# EAGLE design mr_radar_pulser (EAGLE 6.1)
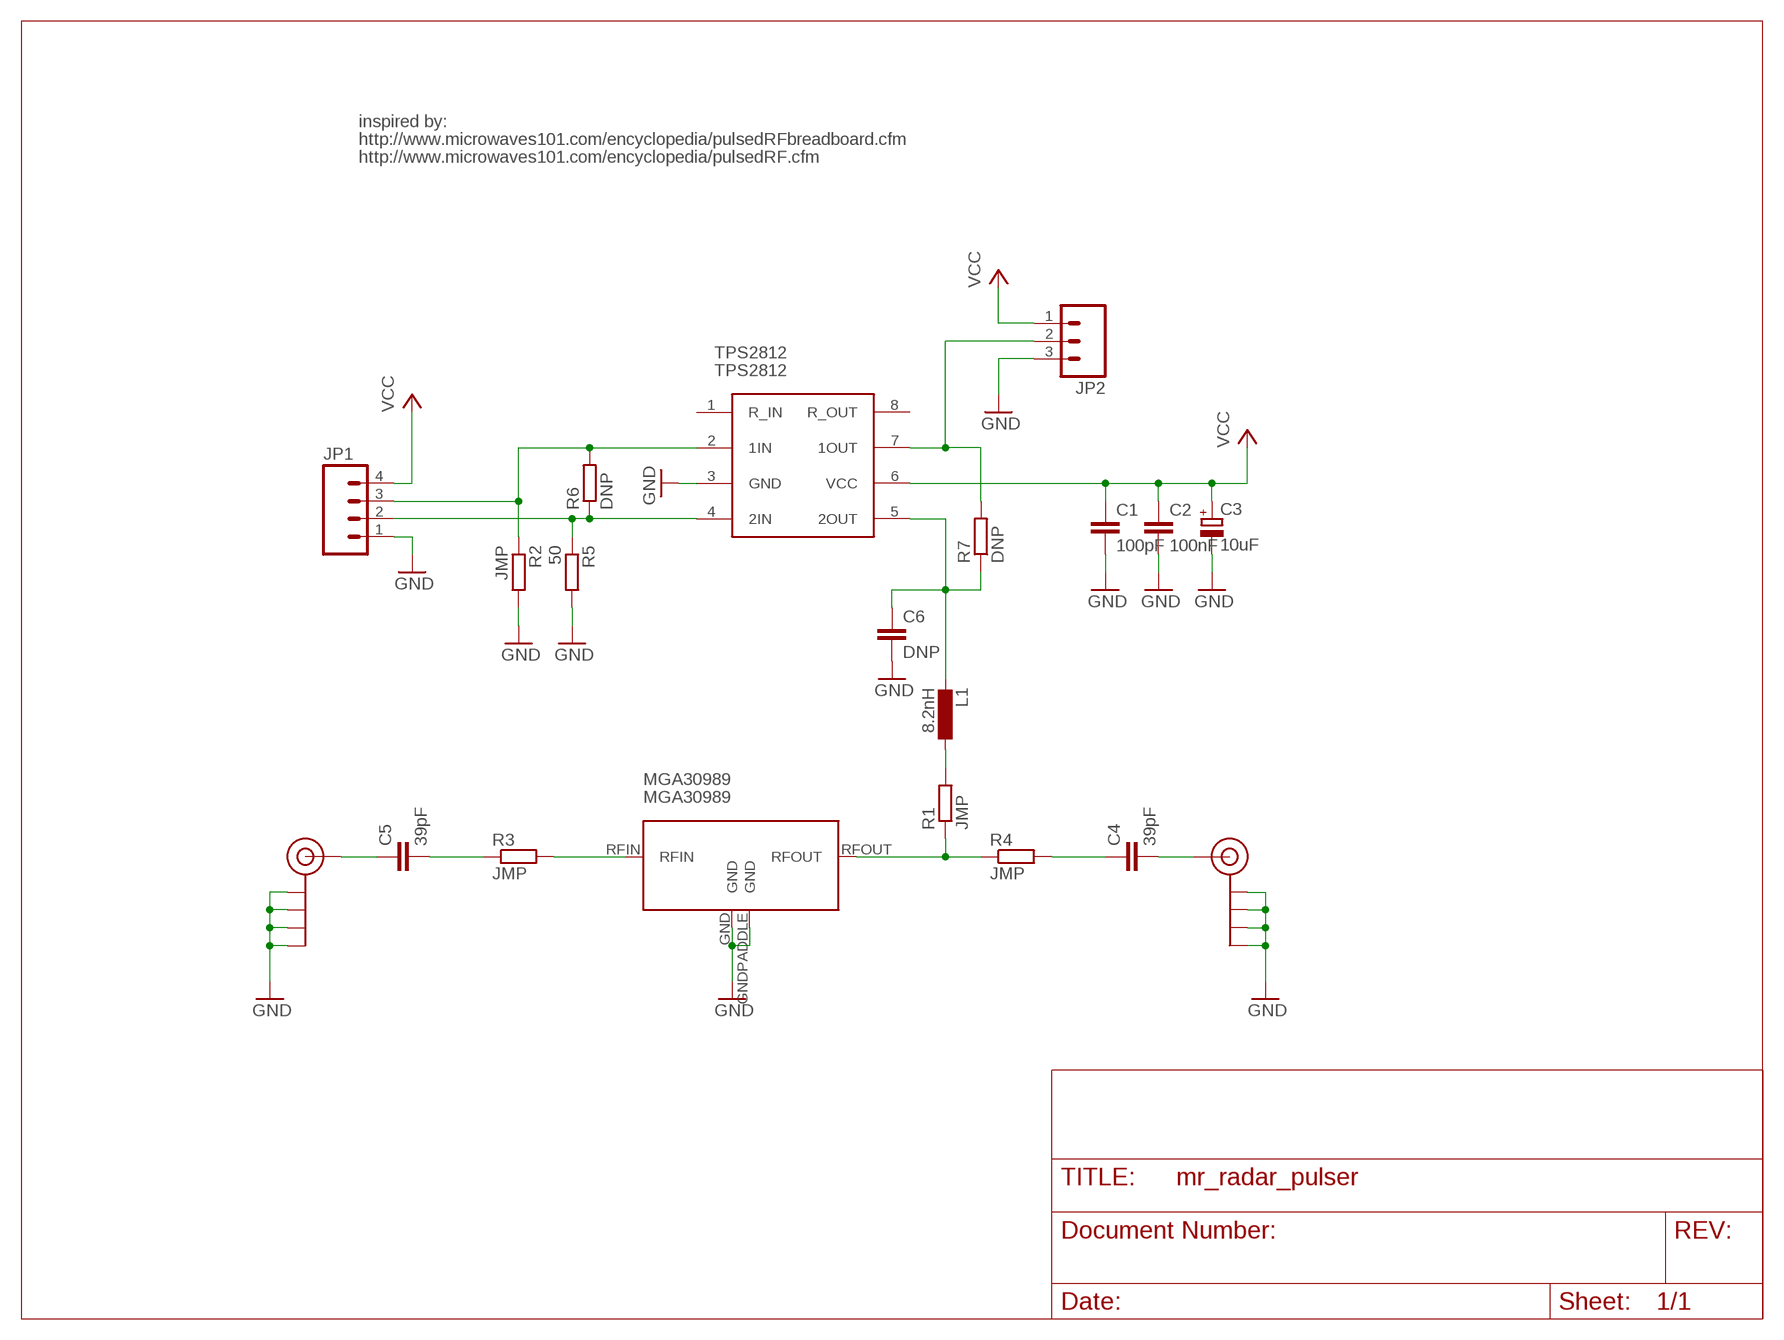
[diagram p0: schematic, sheet 1]

## Parts
C1  100pF  C-EUC0603  [C0603]
C2  100nF  C-EUC0603  [C0603]
C3  10uF  CPOL-EUCT3216  [CT3216]
C4  39pF  C-EUC0402  [C0402]
C5  39pF  C-EUC0402  [C0402]
C6  DNP  C-EUC0603  [C0603]
J$1  SMA_EDGE  [SMA-EDGE]
J$2  SMA_EDGE  [SMA-EDGE]
JP1  M04PTH  [1X04]
JP2  M03PTH  [1X03]
L1  8.2nH  INDUCTOR-0603  [0603-IND]
MGA30989  MGA30989  [SOT89]
R1  JMP  R-EU_R0603  [R0603]
R2  JMP  R-EU_R0603  [R0603]
R3  JMP  R-EU_R0402  [R0402]
R4  JMP  R-EU_R0402  [R0402]
R5  50  R-EU_R0603  [R0603]
R6  DNP  R-EU_R0603  [R0603]
R7  DNP  R-EU_R0603  [R0603]
TPS2812  TPS2812  [SO8]

## Nets
GND: C1.2 C2.2 C3.- C6.2 J$1.GND@0(GND) J$1.GND@1(GND) J$1.GND@2(GND) J$1.GND@3(GND) J$2.GND@0(GND) J$2.GND@1(GND) J$2.GND@2(GND) J$2.GND@3(GND) JP1.1 JP2.3 MGA30989.GND MGA30989.GNDPADDLE(GND) R2.2 R5.2 TPS2812.3(GND)
N$1: C5.1 J$1.SIG(SIGNAL)
N$2: C4.1 R4.2
N$3: MGA30989.RFOUT R1.1 R4.1
N$4: C4.2 J$2.SIG(SIGNAL)
N$5: L1.P$1 R1.2
N$6: C6.1 L1.P$2 R7.1 TPS2812.5(2OUT)
N$7: JP1.3 R2.1 R6.2 TPS2812.2(1IN)
N$8: JP1.2 R5.1 R6.1 TPS2812.4(2IN)
N$9: JP2.2 R7.2 TPS2812.7(1OUT)
N$10: C5.2 R3.1
N$11: MGA30989.RFIN R3.2
VCC: C1.1 C2.1 C3.+ JP1.4 JP2.1 TPS2812.6(VCC)
Unconnected: TPS2812.1(R_IN) TPS2812.8(R_OUT)

## Notes on the sheet
- inspired by:
- http://www.microwaves101.com/encyclopedia/pulsedRFbreadboard.cfm
- http://www.microwaves101.com/encyclopedia/pulsedRF.cfm

## Library data of the parts
C1 C2 C4-C6 = rcl:C-EU: CAPACITOR, European symbol
C3 = rcl:CPOL-EU: POLARIZED CAPACITOR, European symbol
J$1 J$2 = SparkFun:SMA_EDGE: SMA Antenna Connector End launch SMA connector. The paste layer has been removed so that the connector can be hand soldered onto the board after reflow.
JP1 = SparkFun:M04: Header 4 Standard 4-pin 0.1" header. Use with straight break away headers (SKU : PRT-00116), right angle break away headers (PRT-00553), swiss pins (PRT-00743), machine pins (PRT-00117), and female headers (PRT-00115). Molex polarized connector foot print use with SKU : PRT-08231 with associated crimp pins and housings. 1MM SMD Version SKU: PRT-10208
JP2 = SparkFun-Connectors:M03: Header 3 Standard 3-pin 0.1" header. Use with straight break away headers (SKU : PRT-00116), right angle break away headers (PRT-00553), swiss pins (PRT-00743), machine pins (PRT-00117), and female headers (PRT-00115). Molex polarized connector foot print use with SKU : PRT-08232 with associated crimp pins and housings.
L1 = pel_dipol_comp:INDUCTOR
MGA30989 = mr_radar:MGA30989
R1-R7 = rcl:R-EU_: RESISTOR, European symbol
TPS2812 = mr_radar:TPS2812

## Board
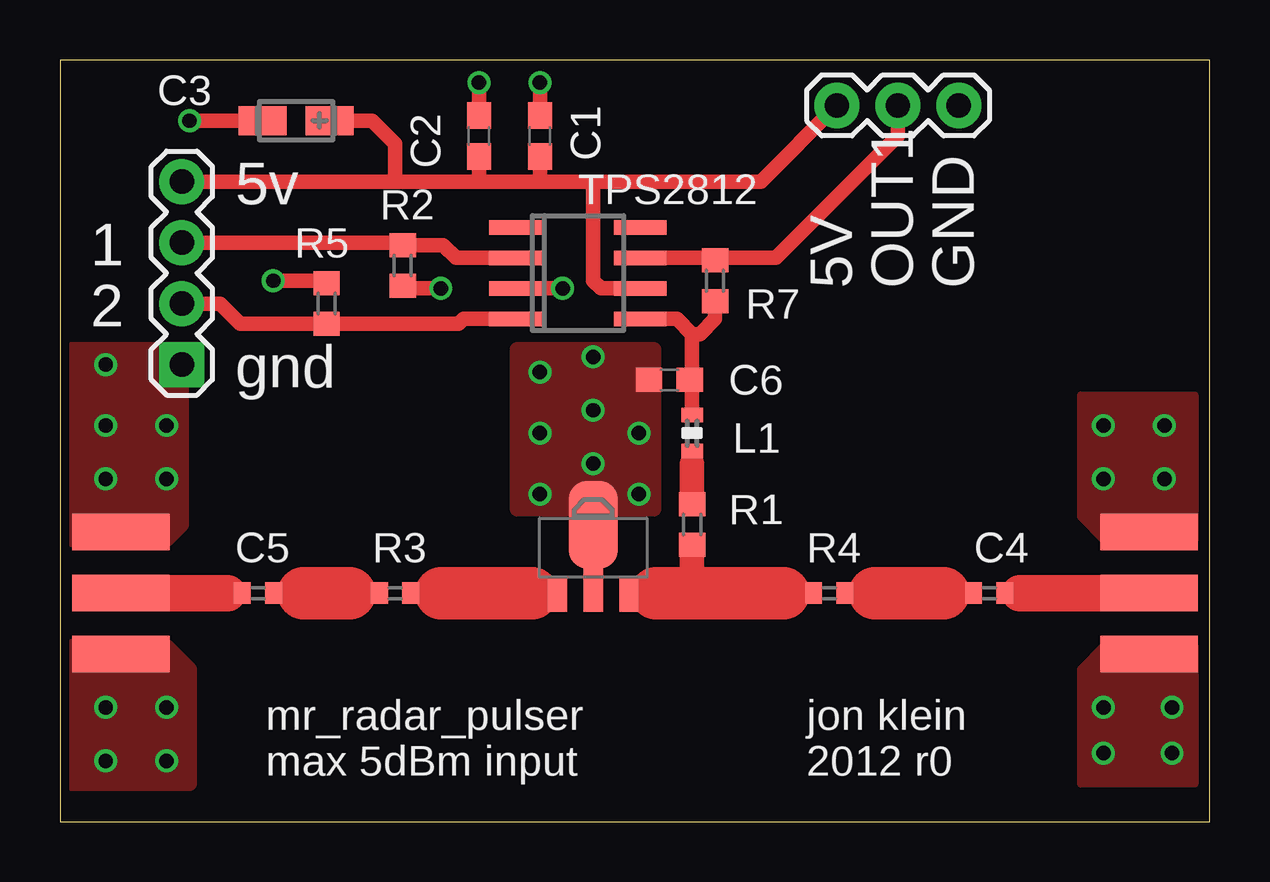
[diagram p1: board, top side]
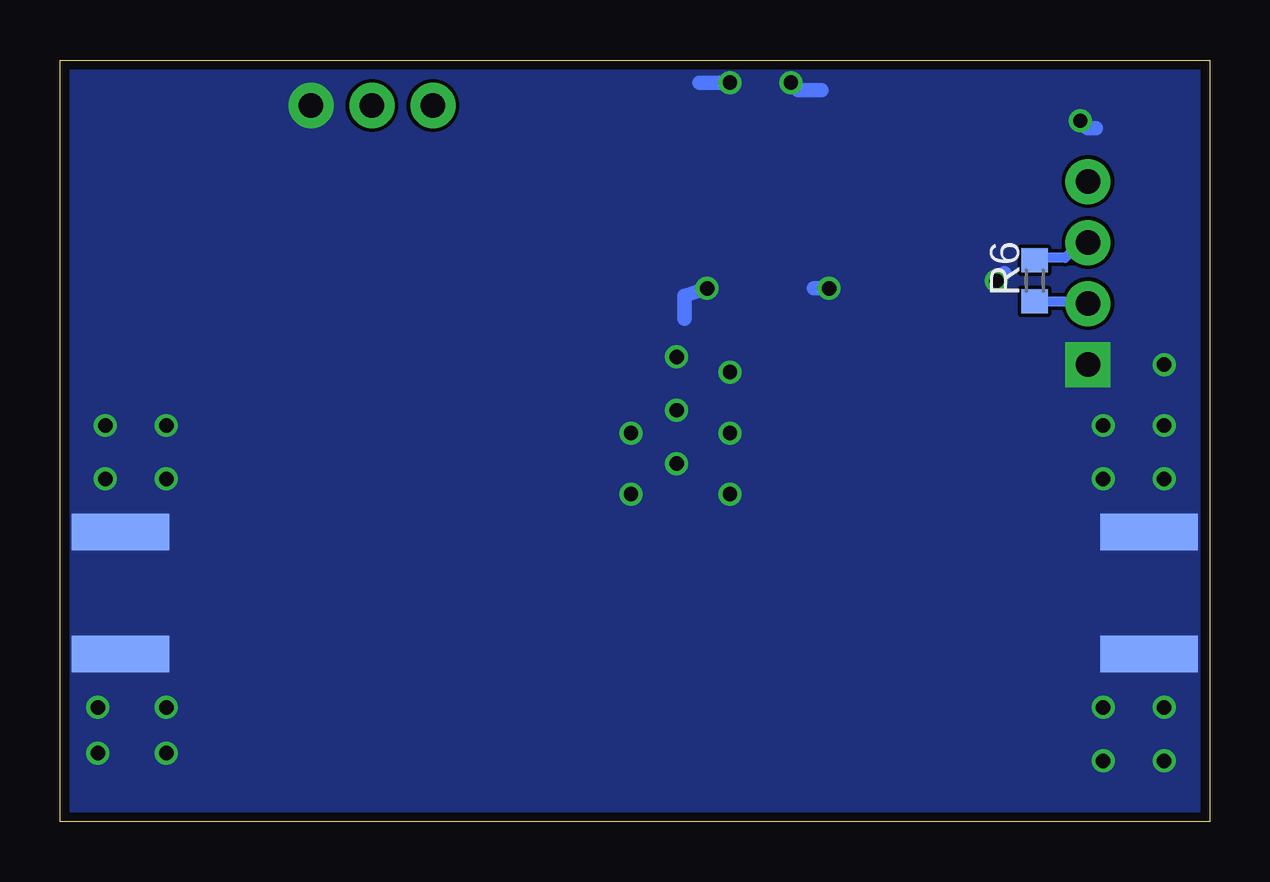
[diagram p2: board, bottom side, seen from below]

Size 47.93 x 31.74 mm. Coordinates in mm from the lower left corner, seen from the top.
Outline: 0,0 47.93,0 47.93,31.74 0,31.74 0,0
Copper layers (1*16): Top 0.0356mm / dielectric 1.5011mm / Bottom 0.0356mm
Design rules: minimum track width 6mil, minimum drill 13mil, track to track 6mil, track to pad 6mil, pad to pad 6mil, via to via 6mil, smd to smd 6mil, copper to edge 15mil, drill to drill 6mil, minimum pad ring 7mil, minimum via ring 7mil, stop-mask expansion 4mil, vias tented up to drill 0mil, thermal gap 10mil

### Footprints (pad centres in the part's own frame; a part is rotated, then mirrored left to right if it is on the bottom)
C0603 = smd 1.1 x 1: 1 -0.85,0; 2 0.85,0
CT3216 = smd 2 x 1.2: + -1.4,0; - 1.4,0
C0402 = smd 0.7 x 0.9: 1 -0.65,0; 2 0.65,0
SMA-EDGE = smd 1.524 x 4.064: GND@0 0,0; GND@1 5.08,0; SIG 2.54,0 | smd 1.524 x 4.064 bottom: GND@2 0,0; GND@3 5.08,0
1X04 = drill 1.016 pad 1.88 square: 1 0,0 | drill 1.016 pad 1.88: 2 2.54,0; 3 5.08,0; 4 7.62,0
1X03 = drill 1.016 pad 1.88: 1 0,0; 2 2.54,0; 3 5.08,0
0603-IND = smd 0.6 x 0.9: P$1 -0.75,0; P$2 0.75,0
SOT89 = smd 0.8 x 1.9: GND 0,-1.727 | smd 2.032 x 3.65: GNDPADDLE 0,0.94 | smd 0.8 x 1.4: RFIN -1.499,-1.981; RFOUT 1.499,-1.981
R0603 = smd 1 x 1.1: 1 -0.85,0; 2 0.85,0
R0402 = smd 0.7 x 0.9: 1 -0.65,0; 2 0.65,0
SO8 = smd 0.6 x 2.2: 1 -1.905,-2.6; 2 -0.635,-2.6; 3 0.635,-2.6; 4 1.905,-2.6; 5 1.905,2.6; 6 0.635,2.6; 7 -0.635,2.6; 8 -1.905,2.6

### Placement (x,y rotation side)
C1  20,28.58 90 top
C2  17.46,28.58 90 top
C3  9.84,29.21 180 top
C4  38.73,9.53 0 top
C5  8.26,9.53 0 top
C6  25.4,18.41 180 top
J$1  2.54,12.06 270 top
J$2  45.4,12.06 270 top
JP1  5.08,19.05 90 top
JP2  32.38,29.84 0 top
L1  26.35,16.19 90 top
MGA30989  22.23,11.43 0 top
R1  26.35,12.38 90 top
R2  14.29,23.18 270 top
R3  13.97,9.53 0 top
R4  32.07,9.53 0 top
R5  11.11,21.59 90 top
R6  7.3,22.54 90 bottom
R7  27.3,22.54 90 top
TPS2812  21.59,22.86 270 top

### Tracks (layer width: path | path; a pad name or v marks a point on that pad's centre or on a via)
GND  (via drill 0.6)
  Top 0.61: R5.2 11.01,22.54 v8.89,22.54 | R2.2 14.39,22.22 v15.88,22.22 | TPS2812.3 v20.95,22.22 | MGA30989.GND MGA30989.GNDPADDLE | C3.- v5.4,29.21 | C2.2 v17.46,30.8 | C1.2 v20,30.8
  Bottom 0.61: v8.89,22.54 8.57,22.86 | v15.88,22.22 16.51,22.22 | v20.95,22.22 21.91,21.91 21.91,20.95 | v5.4,29.21 5.08,28.89 4.76,28.89 | v17.46,30.8 17.14,30.48 16.19,30.48 | v20,30.8 21.27,30.8
  other vias: 20,18.73 20,16.19 20,13.65 22.23,19.37 22.23,17.15 24.13,13.65 24.13,16.19 22.23,14.92 1.91,16.51 1.91,14.29 1.91,19.05 4.45,16.51 4.45,14.29 4.45,4.76 1.91,4.76 1.91,2.54 4.45,2.54 43.5,4.76 46.35,4.76 46.35,2.86 43.5,2.86 43.5,14.29 46.04,14.29 46.04,16.51 43.5,16.51
  pour Bottom (no thermals): -1.27,29.53 -1.27,-14.61 71.12,-14.61 71.12,36.2 -1.59,36.2
  pour Top (no thermals): 19.05,19.69 19.05,13.02 24.77,13.02 24.77,19.69
  pour Top (no thermals): 0.32,7.3 4.45,7.3 5.4,6.35 5.4,1.59 0.32,1.59
  pour Top (no thermals): 0.32,19.69 0.32,11.75 4.45,11.75 5.08,12.38 5.08,19.69
  pour Top (no thermals): 47.31,11.75 43.5,11.75 42.55,12.7 42.55,17.78 47.31,17.78
  pour Top (no thermals): 47.31,7.3 43.5,7.3 42.55,6.35 42.55,1.59 47.31,1.59
N$1
  Top 0.406: 6.67,9.53 6.99,9.53 C5.1
  Top 1.524: J$1.SIG 6.99,9.53
N$2
  Top 0.406: R4.2 33.97,9.53 | 36.83,9.53 C4.1
  Top 2.184: 33.97,9.53 36.83,9.53
N$3
  Top 0.406: MGA30989.RFOUT 25.72,9.45 | 30.16,9.53 R4.1
  Top 1.016: R1.1 26.35,9.53 | 25.72,9.45 25.79,9.53 26.04,9.53
  Top 2.184: 24.84,9.53 26.04,9.53 26.35,9.53 30.16,9.53
N$4
  Top 0.406: C4.2 40.01,9.53
  Top 1.524: 40.01,9.53 J$2.SIG
N$5
  Top 0.406: 26.35,14.92 L1.P$1
  Top 1.016: R1.2 26.35,14.92
N$6
  Top 0.61: TPS2812.5 25.72,20.95 26.35,20.32 | L1.P$2 26.35,18.42 | 26.35,18.42 26.35,20.32 | 26.35,18.42 C6.1 | R7.1 27.3,20.95 26.67,20.32 26.35,20.32
N$7
  Top 0.61: JP1.3 14.19,24.13 R2.1 15.98,24.03 16.51,23.49 TPS2812.2
  Bottom 0.305: R6.2 7.3,23.49
  Bottom 0.406: JP1.3 5.4,24.13 6.03,23.49 7.3,23.49
N$8
  Top 0.61: TPS2812.4 16.83,20.95 16.61,20.74 R5.1 7.52,20.74 6.67,21.59 JP1.2
  Bottom 0.406: R6.1 5.18,21.69 JP1.2
N$9
  Top 0.61: TPS2812.7 27.3,23.49 R7.2 27.41,23.49 29.84,23.49 34.92,28.58 JP2.2
N$10
  Top 0.406: C5.2 10.16,9.53 | 12.06,9.53 R3.1
  Top 2.184: 10.16,9.53 12.06,9.53
N$11
  Top 0.406: R3.2 15.88,9.53 | 19.68,9.53 20.73,9.53 MGA30989.RFIN
  Top 2.184: 15.88,9.53 19.68,9.53
VCC
  Top 0.61: TPS2812.6 22.54,22.22 22.23,22.54 22.23,26.67 | 20,26.67 17.46,26.67 | 17.46,26.67 13.97,26.67 | 13.97,26.67 JP1.4 | C2.1 17.46,26.67 | C1.1 20,26.67 | C3.+ 13.02,29.21 13.97,28.26 13.97,26.67 | JP2.1 29.21,26.67 22.23,26.67 | 20,26.67 21.91,26.67 22.23,26.67

### Text on the board
_tsilk: 5v | 1 | 5V | OUT1 | GND | 2 | gnd | mr_radar_pulser | jon klein | max 5dBm input | 2012 r0